# EAGLE design 549-team5 (EAGLE 7.2.0)
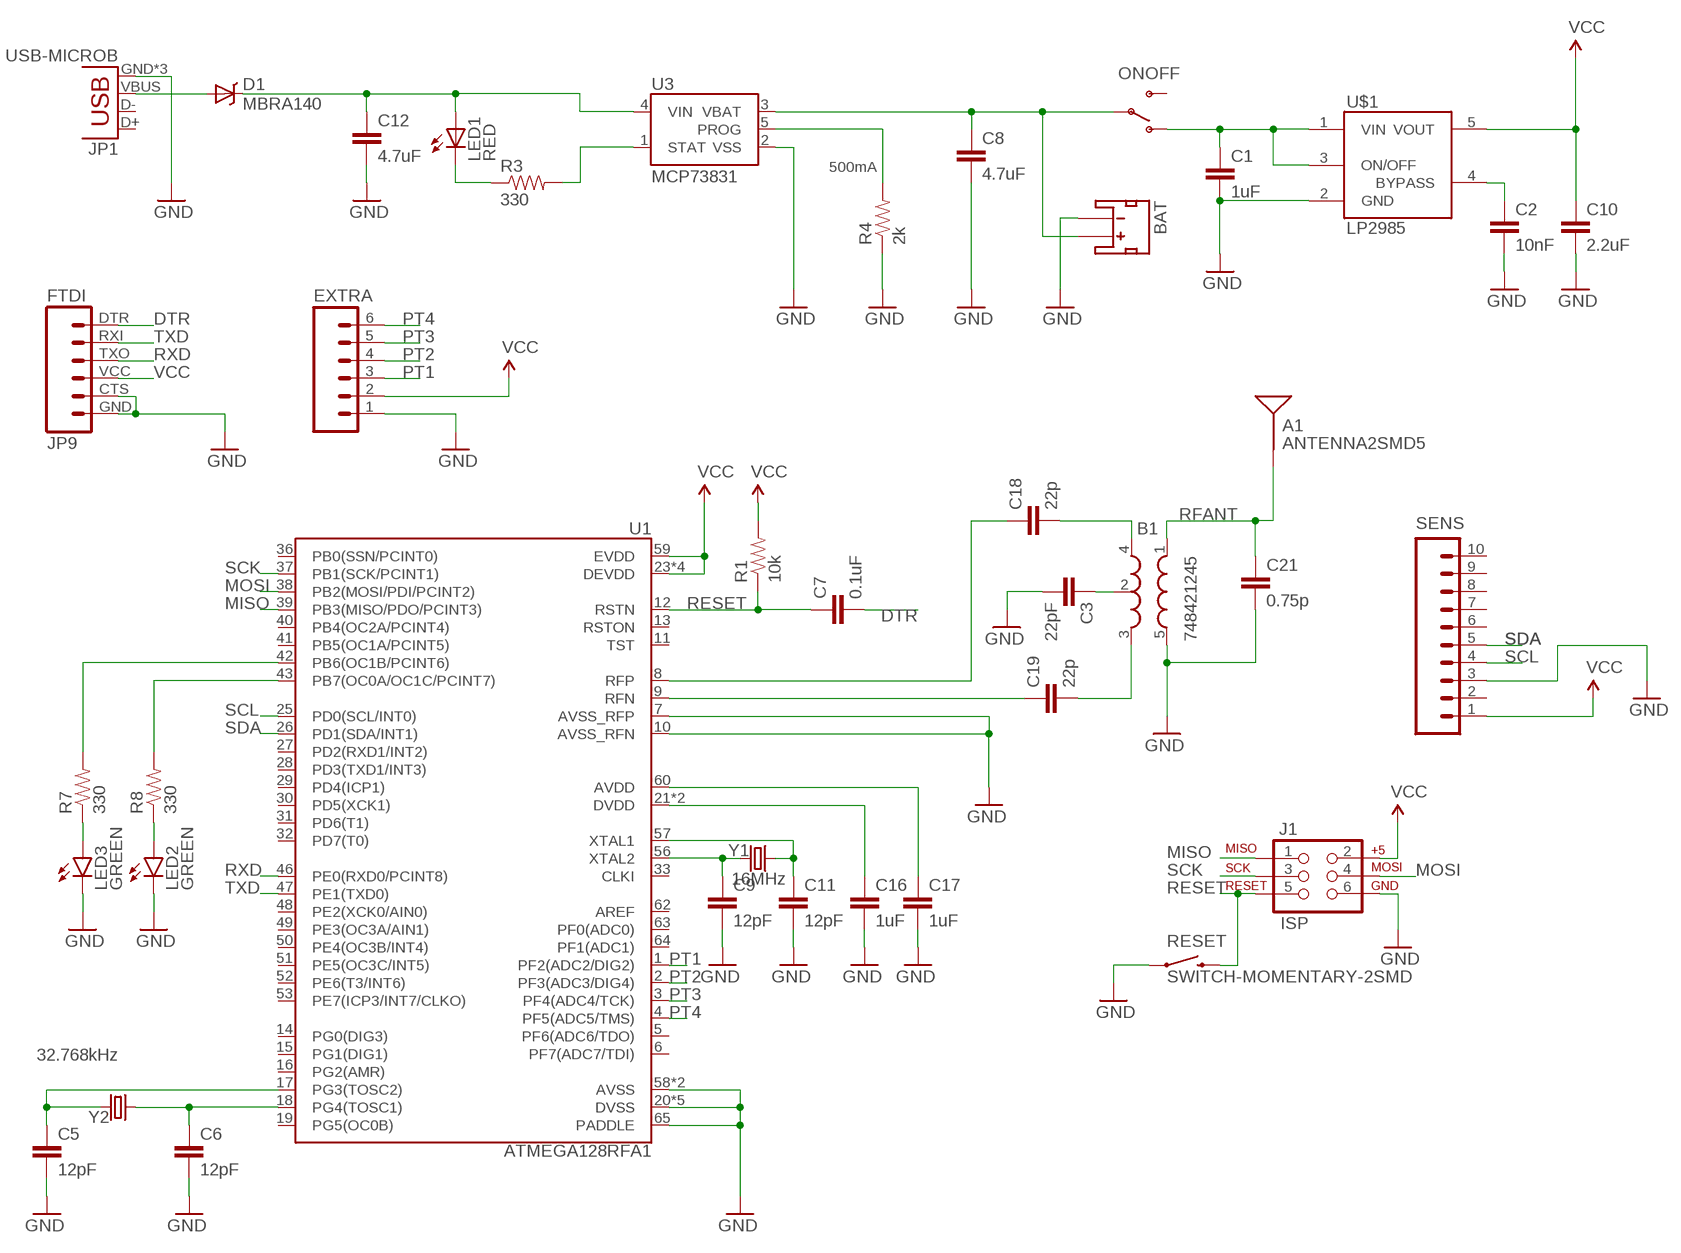
[diagram p0: schematic, sheet 1]

## Parts
A1  ANTENNA2SMD5  [ANTENNA-CHIP5]
B1  748421245  BALUN0805  [BALUN]
BAT  JST_2MM_MALE  [JST-2-SMD]
C1  1uF  CAP1206  [1206]
C2  10nF  CAP1206  [1206]
C3  22pF  CAP1206  [1206]
C5  12pF  CAP1206  [1206]
C6  12pF  CAP1206  [1206]
C7  0.1uF  CAP1206  [1206]
C8  4.7uF  CAP1206  [1206]
C9  12pF  CAP1206  [1206]
C10  2.2uF  CAP1206  [1206]
C11  12pF  CAP1206  [1206]
C12  4.7uF  CAP1206  [1206]
C16  1uF  CAP1206  [1206]
C17  1uF  CAP1206  [1206]
C18  22p  CAP1206  [1206]
C19  22p  CAP1206  [1206]
C21  0.75p  CAP1206  [1206]
D1  MBRA140  [SMA-DIODE]
EXTRA  M06SILK_FEMALE_PTH  [1X06]
J1  ISP  AVR_SPI_PRG_6NS  [2X3-NS]
JP1  USB-MICROB  [USB-MICROB]
JP9  FTDI  FTDI_BASICPTH  [FTDI_BASIC]
LED1  RED  LED1206  [LED-1206]
LED2  GREEN  LED1206  [LED-1206]
LED3  GREEN  LED1206  [LED-1206]
ONOFF  SWITCH-SPST-SMD-A  [SWITCH-SPST-SMD-A]
R1  10k  RESISTOR1206  [1206]
R3  330  RESISTOR1206  [1206]
R4  2k  RESISTOR1206  [1206]
R7  330  RESISTOR1206  [1206]
R8  330  RESISTOR1206  [1206]
RESET  SWITCH-MOMENTARY-2SMD  [TACTILE-SWITCH-SMD]
SENS  M10SILK_FEMALE_PTH  [1X10]
U1  ATMEGA128RFA1  [QFN-64]
U3  MCP73831  [SOT23-5]
U$1  LP2985AIM5-3.3  [SOT25]
Y1  16MHz  CRYSTAL5X3  [CRYSTAL-SMD-5X3]
Y2  32.768kHz  CRYSTAL32-SMD  [CRYSTAL-32KHZ-SMD]

## Nets
AVDD: C17.1 U1.60(AVDD)
BYPASS: C2.1 U$1.4(BYPASS)
DTR: C7.2 JP9.DTR
DVDD: C16.1 U1.21(DVDD) U1.22(DVDD)
GND: B1.5(GND) BAT.1(-) C1.2 C2.2 C3.2 C5.2 C6.2 C8.2 C9.2 C10.2 C11.2 C12.2 C16.2 C17.2 C21.2 EXTRA.1 J1.6 JP1.GND JP1.MT1(GND) JP1.MT2(GND) JP9.CTS JP9.GND LED2.C LED3.C R4.1 RESET.1 SENS.3 U1.7(AVSS_RFP) U1.10(AVSS_RFN) U1.20(DVSS) U1.24(DVSS) U1.35(DVSS) U1.45(DVSS) U1.55(DVSS) U1.58(AVSS) U1.61(AVSS) U1.65(PADDLE) U3.2(VSS) U$1.2(GND)
MISO: J1.1 U1.39(PB3(MISO/PDO/PCINT3))
MOSI: J1.4 U1.38(PB2(MOSI/PDI/PCINT2))
N$1: R8.2 U1.43(PB7(OC0A/OC1C/PCINT7))
N$3: C11.1 U1.57(XTAL1) Y1.3
N$4: C9.1 U1.56(XTAL2) Y1.1
N$5: C6.1 U1.18(PG4(TOSC1)) Y2.X1
N$6: C5.1 U1.17(PG3(TOSC2)) Y2.X2
N$7: C1.1 ONOFF.1(O) U$1.1(VIN) U$1.3(ON/OFF)
N$8: LED3.A R7.1
N$9: BAT.2(+) C8.1 ONOFF.2(P) U3.3(VBAT)
N$10: B1.4(OUT1) C18.2
N$11: B1.3(OUT2) C19.2
N$12: R7.2 U1.42(PB6(OC1B/PCINT6))
N$13: LED2.A R8.1
N$14: B1.2(GND) C3.1
N$15: C12.1 D1.C LED1.A U3.4(VIN)
N$18: R3.2 U3.1(STAT)
N$19: LED1.C R3.1
N$20: D1.A JP1.VBUS
PROG: R4.2 U3.5(PROG)
PT1: EXTRA.3 U1.1(PF2(ADC2/DIG2))
PT2: EXTRA.4 U1.2(PF3(ADC3/DIG4))
PT3: EXTRA.5 U1.3(PF4(ADC4/TCK))
PT4: EXTRA.6 U1.4(PF5(ADC5/TMS))
RESET: C7.1 J1.5 R1.1 RESET.3 U1.12(RSTN)
RFANT: A1.FEED(SIGNAL) B1.1(IN) C21.1
RFN: C19.1 U1.9(RFN)
RFP: C18.1 U1.8(RFP)
RXD: JP9.TXO U1.46(PE0(RXD0/PCINT8))
SCK: J1.3 U1.37(PB1(SCK/PCINT1))
SCL: SENS.4 U1.25(PD0(SCL/INT0))
SDA: SENS.5 U1.26(PD1(SDA/INT1))
TXD: JP9.RXI U1.47(PE1(TXD0))
VCC: C10.1 EXTRA.2 J1.2 JP9.VCC R1.2 SENS.1 U1.23(DEVDD) U1.34(DEVDD) U1.44(DEVDD) U1.54(DEVDD) U1.59(EVDD) U$1.5(VOUT)
Unconnected: BAT.NC1(PAD1) BAT.NC2(PAD2) JP1.D+ JP1.D- ONOFF.3(S) SENS.2 SENS.6 SENS.7 SENS.8 SENS.9 SENS.10 U1.5(PF6(ADC6/TDO)) U1.6(PF7(ADC7/TDI)) U1.11(TST) U1.13(RSTON) U1.14(PG0(DIG3)) U1.15(PG1(DIG1)) U1.16(PG2(AMR)) U1.19(PG5(OC0B)) U1.27(PD2(RXD1/INT2)) U1.28(PD3(TXD1/INT3)) U1.29(PD4(ICP1)) U1.30(PD5(XCK1)) U1.31(PD6(T1)) U1.32(PD7(T0)) U1.33(CLKI) U1.36(PB0(SSN/PCINT0)) U1.40(PB4(OC2A/PCINT4)) U1.41(PB5(OC1A/PCINT5)) U1.48(PE2(XCK0/AIN0)) U1.49(PE3(OC3A/AIN1)) U1.50(PE4(OC3B/INT4)) U1.51(PE5(OC3C/INT5)) U1.52(PE6(T3/INT6)) U1.53(PE7(ICP3/INT7/CLKO)) U1.62(AREF) U1.63(PF0(ADC0)) U1.64(PF1(ADC1))

## Notes on the sheet
- 500mA

## Library data of the parts
A1 = SparkFun-RF:ANTENNA2: Chip antenna Single endded antenna. Common with smaller chip antennas. CHIP4 package is the GPS Chip Antenna SKU: GPS-08418. CHIP5 package is 2.4GHz chip antenna SKU: WRL-00144.
B1 = SparkFun-RF:BALUN: 0805 footprint balun- Ember 351/357
BAT = SparkFun-Connectors:JST_2MM_MALE: Mates to single-cell LiPo batteries. CONN-08352; PROD_ID: CONN-08352
C1-C3 C5-C12 C16-C19 C21 = SparkFun-Capacitors:CAP: Capacitor Standard 0603 ceramic capacitor, and 0.1" leaded capacitor.
D1 = SparkFun-DiscreteSemi:MBRA140: 40V, 1A Schottky rectifier SMA/DO-214AC package DIO-08053; PROD_ID: DIO-08053
EXTRA = SparkFun-Connectors:M06: Header 6 Standard 6-pin 0.1" header. Use with straight break away headers (SKU : PRT-00116), right angle break away headers (PRT-00553), swiss pins (PRT-00743), machine pins (PRT-00117), and female headers (PRT-00115). Molex polarized connector foot print use with SKU : PRT-08094 with associated crimp pins and housings. NOTES ON THE VARIANTS LOCK and LOCK_LONGPADS... This footprint was designed to help hold the alignment of a through-hole component (i.e. 6-pin header) while soldering it into place. You may notice that each hole has been shifted either up or down by 0.005 of an inch from it's more standard position (which is a perfectly straight line). This slight alteration caused the pins (the squares in the middle) to touch the edges of the holes. Because they are alternating, it causes a "brace" to hold the component in place. 0.005 has proven to be the perfect amount of "off-center" position when using our standard breakaway headers. Although looks a little odd when you look at the bare footprint, once you have a header in there, the alteration is very hard to notice. Also,if you push a header all the way into place, it is covered up entirely on the bottom side. This idea of altering the position of holes to aid alignment will be further integrated into the Sparkfun Library for other footprints. It can help hold any component with 3 or more connection pins.; PROD_ID: CONN-08437
J1 = SparkFun-Connectors:AVR_SPI_PRG_6: AVR ISP 6 Pin This is the reduced ISP connector for AVR programming. Common on Arduino. This footprint will take up less PCB space and can be used with a 10-pin to 6-pin adapter such as SKU: BOB-08508
JP1 = SparkFun-Connectors:USB: USB Connectors USB-B-PTH is fully proven SKU : PRT-00139/CONN-08278 USB-miniB is fully proven SKU : PRT-00587 USB-A-PCB is untested. USB-A-H is throughly reviewed, but untested. Spark Fun Electronics SKU : PRT-00437 USB-B-SMT is throughly reviewed, but untested. Needs silkscreen touching up. USB-A-S has not been used/tested USB-MB-H has not been used/tested USB-MICROB has been used. CONN-09505; PROD_ID: CONN-09505
JP9 = SparkFun-Connectors:FTDI_BASIC: FTDI Basic header with labels
LED1 = LilyPad-Wearables:LED: LEDs
LED2 LED3 = SparkFun-LED:LED: LEDs
ONOFF = SparkFun:SWITCH-SPST: SPST Switch Simple slide switch. Spark Fun Electronics SKU : COM-00102
R1 R3 R4 R7 R8 = SparkFun-Passives:RESISTOR: Resistor Basic schematic elements and footprints for 0603, 1206, and PTH resistors.
RESET = SparkFun-Electromechanical:SWITCH-MOMENTARY-2: Various NO switches- pushbuttons, reed, etc; PROD_ID: SWCH-08247
SENS = SparkFun-Connectors:M10: Header 10 Standard 10-pin 0.1" header. Use with straight break away headers (SKU : PRT-00116), right angle break away headers (PRT-00553), swiss pins (PRT-00743), machine pins (PRT-00117), and female headers (PRT-00115).; PROD_ID: CONN-11563
U1 = SparkFun-DigitalIC:ATMEGA128RFA1: ATmega128RFA1 8-bit AVR Microcontroller with Low Power 2.4GHz Transceiver for ZigBee and IEEE 802.15.4
U3 = SparkFun-PowerIC:MCP73831: Miniature single cell, fully integrated Li-Ion, Li-polymer charge management controller http://ww1.microchip.com/downloads/en/DeviceDoc/21984a.pdf IC-09995; PROD_ID: IC-09995
U$1 = LP2985:LP2985: LP2985-N Micropower 150 mA Low-Noise Ultra Low-Dropout Regulator
Y1 Y2 = SparkFun-FreqCtrl:CRYSTAL: Various standard crystals. Proven footprints. Spark Fun Electronics SKU : COM-00534

## Board
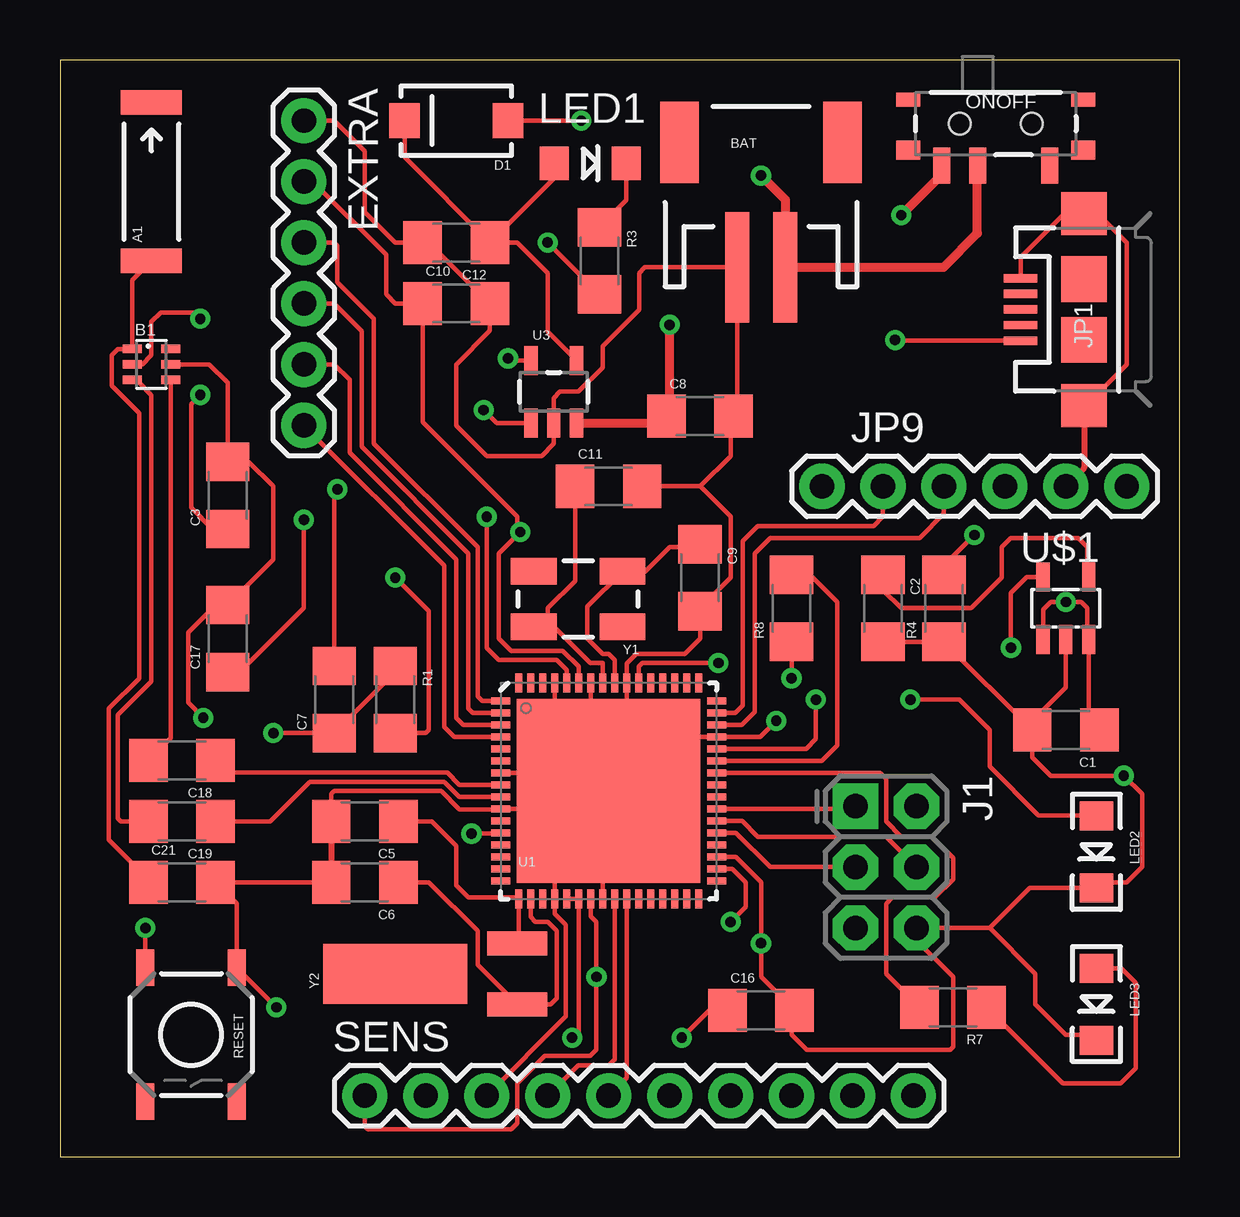
[diagram p1: board, top side]
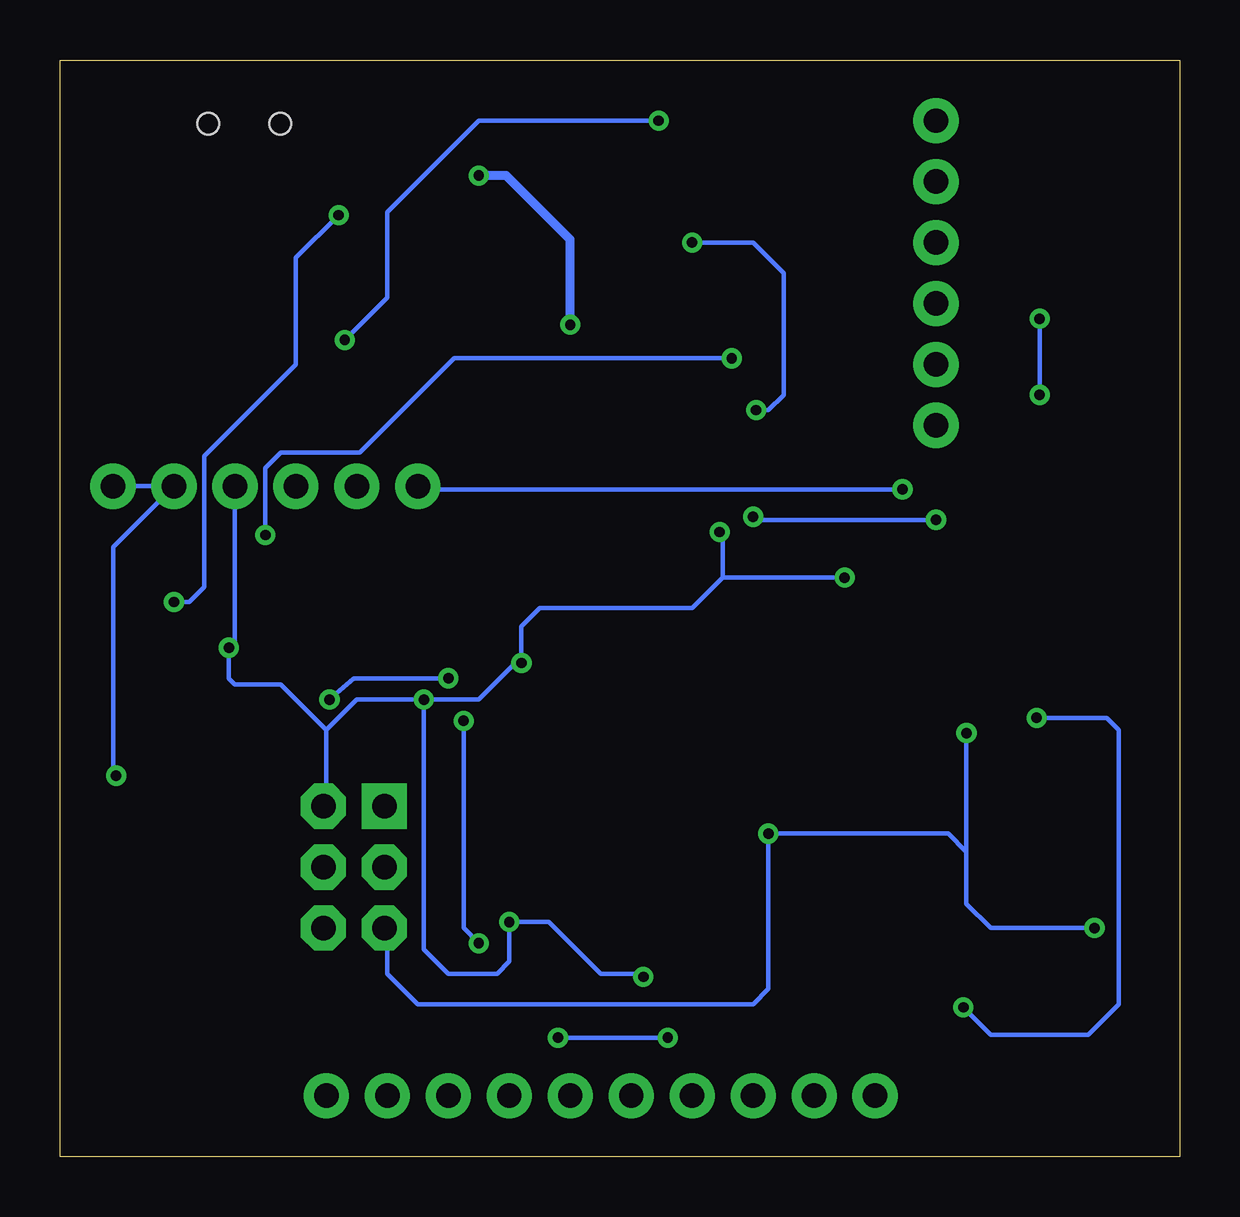
[diagram p2: board, bottom side, seen from below]

Size 46.66 x 45.71 mm. Coordinates in mm from the lower left corner, seen from the top.
Outline: 0,0 46.66,0 46.66,45.71 0,45.71 0,0
Copper layers (1*16): Top 0.035mm / dielectric 1.5mm / Bottom 0.035mm
Design rules "default *": minimum track width 7mil, minimum drill 16mil, track to track 7mil, track to pad 7mil, pad to pad 7mil, via to via 7mil, smd to smd 7mil, copper to edge 40mil, drill to drill 7mil, minimum pad ring 10mil, minimum via ring 8mil, stop-mask expansion 4mil, vias tented up to drill 0mil, thermal gap 10mil

### Footprints (pad centres in the part's own frame; a part is rotated, then mirrored left to right if it is on the bottom)
ANTENNA-CHIP5 = smd 1.016 x 2.54: FEED -3.302,0; NC 3.302,0
BALUN = smd 0.35 x 0.8: 1 -0.65,-0.8; 2 0,-0.8; 3 0.65,-0.8; 4 0.65,0.8; 5 0,0.8; 6 -0.65,0.8
JST-2-SMD = smd 1 x 4.6: 1 -1,-3.7; 2 1,-3.7 | smd 1.6 x 3.4: NC1 -3.4,1.5; NC2 3.4,1.5
1206 = smd 1.6 x 1.8: 1 -1.4,0; 2 1.4,0
SMA-DIODE = smd 1.27 x 1.47: A -2.15,0; C 2.15,0
1X06 = drill 1.016 pad 1.88: 1 0,0; 2 2.54,0; 3 5.08,0; 4 7.62,0; 5 10.16,0; 6 12.7,0
2X3-NS = drill 1.016 pad 1.88 square: 1 -2.54,-1.27 | drill 1.016 pad 1.88 octagon: 2 -2.54,1.27; 3 0,-1.27; 4 0,1.27; 5 2.54,-1.27; 6 2.54,1.27
USB-MICROB = smd 0.35 x 1.4: D+ 0,2.65; D- -0.65,2.65; GND 1.3,2.65; ID 0.65,2.65; VBUS -1.3,2.65 | smd 1.8 x 1.9: MT1 -4,0; MT2 4,0 | smd 1.9 x 1.9: P$1 -1.27,0; P$2 1.27,0
FTDI_BASIC = drill 1.016 pad 1.88: CTS 10.16,0; DTR 0,0; GND 12.7,0; RXI 2.54,0; TXO 5.08,0; VCC 7.62,0
LED-1206 = smd 1.2 x 1.4: A -1.5,0; C 1.5,0
SWITCH-SPST-SMD-A = smd 0.7 x 1.5: 1 -2.25,-1.75; 2 -0.75,-1.75; 3 2.25,-1.75 | smd 1 x 0.6: GND1 -3.65,1; GND3 3.65,1 | smd 1 x 0.8: GND2 -3.65,-1.1; GND4 3.65,-1.1 | hole 0.9: -1.5,0; 1.5,0
TACTILE-SWITCH-SMD = smd 1.524 x 0.762: 1 -2.794,1.905; 2 2.794,1.905; 3 -2.794,-1.905; 4 2.794,-1.905
1X10 = drill 1.016 pad 1.88: 1 0,0; 2 2.54,0; 3 5.08,0; 4 7.62,0; 5 10.16,0; 6 12.7,0; 7 15.24,0; 8 17.78,0; 9 20.32,0; 10 22.86,0
QFN-64 = smd 0.8 x 0.28: 1 -4.5,3.75; 2 -4.5,3.25; 3 -4.5,2.75; 4 -4.5,2.25; 5 -4.5,1.75; 6 -4.5,1.25; 7 -4.5,0.75; 8 -4.5,0.25; 9 -4.5,-0.25; 10 -4.5,-0.75; 11 -4.5,-1.25; 12 -4.5,-1.75; 13 -4.5,-2.25; 14 -4.5,-2.75; 15 -4.5,-3.25; 16 -4.5,-3.75; 33 4.5,-3.75; 34 4.5,-3.25; 35 4.5,-2.75; 36 4.5,-2.25; 37 4.5,-1.75; 38 4.5,-1.25; 39 4.5,-0.75; 40 4.5,-0.25; 41 4.5,0.25; 42 4.5,0.75; 43 4.5,1.25; 44 4.5,1.75; 45 4.5,2.25; 46 4.5,2.75; 47 4.5,3.25; 48 4.5,3.75 | smd 0.28 x 0.8: 17 -3.75,-4.5; 18 -3.25,-4.5; 19 -2.75,-4.5; 20 -2.25,-4.5; 21 -1.75,-4.5; 22 -1.25,-4.5; 23 -0.75,-4.5; 24 -0.25,-4.5; 25 0.25,-4.5; 26 0.75,-4.5; 27 1.25,-4.5; 28 1.75,-4.5; 29 2.25,-4.5; 30 2.75,-4.5; 31 3.25,-4.5; 32 3.75,-4.5; 49 3.75,4.5; 50 3.25,4.5; 51 2.75,4.5; 52 2.25,4.5; 53 1.75,4.5; 54 1.25,4.5; 55 0.75,4.5; 56 0.25,4.5; 57 -0.25,4.5; 58 -0.75,4.5; 59 -1.25,4.5; 60 -1.75,4.5; 61 -2.25,4.5; 62 -2.75,4.5; 63 -3.25,4.5; 64 -3.75,4.5 | smd 7.65 x 7.65: 65 0,0
SOT23-5 = smd 0.55 x 1.2: 1 -0.95,-1.3; 2 0,-1.3; 3 0.95,-1.3; 4 0.95,1.3; 5 -0.95,1.3
SOT25 = smd 0.55 x 1.2: 1 -0.95,-1.3; 2 0,-1.3; 3 0.95,-1.3; 4 0.95,1.3; 5 -0.95,1.3
CRYSTAL-SMD-5X3 = smd 1.9 x 1.1: 1 -1.85,-1.15; 2 1.85,-1.15; 3 1.85,1.15; 4 -1.85,1.15
CRYSTAL-32KHZ-SMD = smd 2.5 x 6: SHEILD 0,5.08 | smd 1 x 2.5: X1 -1.27,0; X2 1.27,0

### Placement (x,y rotation side)
A1  3.81,40.64 90 top
B1  3.81,33.02 270 top
BAT  29.21,40.77 0 top
C1  41.91,17.78 180 top
C2  34.29,22.86 270 top
C3  6.99,27.56 90 top
C5  12.7,13.97 180 top
C6  12.7,11.43 180 top
C7  11.43,19.05 90 top
C8  26.67,30.86 0 top
C9  26.67,24.13 270 top
C10  16.51,35.56 0 top
C11  22.86,27.94 0 top
C12  16.51,38.1 180 top
C16  29.21,6.1 0 top
C17  6.99,21.59 90 top
C18  5.08,16.51 180 top
C19  5.08,13.97 180 top
C21  5.08,11.43 0 top
D1  16.51,43.18 180 top
EXTRA  10.16,43.18 270 top
J1  34.42,12.06 270 top
JP1  42.67,35.31 90 top
JP9  31.75,27.94 0 top
LED1  22.1,41.4 0 top
LED2  43.18,12.7 270 top
LED3  43.18,6.35 270 top
ONOFF  38.99,43.05 0 top
R1  13.97,19.05 270 top
R3  22.48,37.34 270 top
R4  36.83,22.86 90 top
R7  37.21,6.22 180 top
R8  30.48,22.86 90 top
RESET  5.46,5.08 270 top
SENS  12.7,2.54 0 top
U1  22.86,15.24 0 top
U3  20.57,31.88 0 top
U$1  41.91,22.86 0 top
Y1  21.59,23.24 180 top
Y2  19.05,7.62 90 top

### Tracks (layer width: path | path; a pad name or v marks a point on that pad's centre or on a via)
AVDD  (via drill 0.43)
  Top 0.178: U1.60 21.11,20.29 20.7,20.7 18.29,20.7 17.78,21.21 v17.78,26.67 | C17.1 7.49,20.19 10.16,22.86 v10.16,26.54
  Bottom 0.178: v10.16,26.54 17.65,26.54 v17.78,26.67
BYPASS
  Top 0.178: C2.1 34.29,23.62 35.05,22.86 37.97,22.86 39.24,24.13 39.24,25.4 39.62,25.78 42.42,25.78 42.8,25.4 42.8,24.22 U$1.4
DTR  (via drill 0.43)
  Top 0.178: C7.2 11.43,27.69 v11.56,27.81
  Bottom 0.178: v11.56,27.81 31.62,27.81 JP9.DTR
DVDD  (via drill 0.43)
  Top 0.178: U1.21 U1.22 21.61,5.23 v21.34,4.95 | C16.1 27.05,6.1 v25.91,4.95
  Bottom 0.178: v21.34,4.95 v25.91,4.95
GND  (via drill 0.43)
  Top 0.178: SENS.3 21.08,5.84 21.08,9.65 20.61,10.12 U1.20 20.61,15.24 | U1.35 28.15,12.49 29.21,11.43 v29.21,8.89 29.21,7.5 C16.2 30.48,5.97 30.48,5.08 31.11,4.45 37.08,4.45 37.21,4.57 37.21,7.49 35.69,9.02 J1.6 38.73,9.53 | 38.73,9.53 40.64,7.62 40.64,6.35 41.91,5.08 42.95,5.08 LED3.C | U1.7 20.32,15.99 | 20.32,15.99 21.59,15.99 | 21.59,15.99 22.11,15.99 U1.65 22.61,14.99 U1.24 | U1.58 22.11,17.78 | 22.11,17.78 22.11,16.51 21.59,15.99 | U1.61 20.61,16.28 20.32,15.99 | 23.61,18.53 U1.55 23.61,20.56 24,20.95 26.04,20.95 26.67,21.59 C9.2 26.67,22.86 27.94,24.13 27.94,26.67 26.67,27.94 | 23.61,18.53 22.86,17.78 22.11,17.78 | 23.61,18.53 24.65,17.49 U1.45 29.17,17.49 v29.84,18.16 | 20.61,15.24 20.61,15.7 20.32,15.99 | 20.61,15.24 19.86,14.49 U1.10 18.35,14.48 16.64,14.48 15.88,15.24 11.43,15.24 11.3,15.11 C5.2 | C6.2 C21.2 7.37,10.54 RESET.1 v9.02,6.22 | B1.5 6.22,33.02 6.99,32.26 C3.2 7.87,28.96 8.89,27.94 8.89,24.89 C17.2 6.48,22.99 5.33,21.84 5.33,18.92 v5.97,18.29 | 38.73,9.53 40.41,11.2 LED2.C 43.41,11.43 44.45,11.43 45.09,12.06 45.09,15.11 v44.32,15.88 41.27,15.88 40.51,16.64 C1.2 | U$1.2 41.91,19.56 40.64,18.29 40.64,17.91 C1.2 | EXTRA.1 11.43,43.18 12.7,41.91 12.7,39.37 13.97,38.1 C12.2 15.37,38.1 C10.2 17.91,34.42 16.51,33.02 16.51,30.48 17.78,29.21 20.07,29.21 20.57,29.72 U3.2 20.57,31.62 20.83,31.88 21.59,31.88 22.61,32.89 22.61,33.78 24.13,35.31 24.13,36.83 24.37,37.07 BAT.1 28.21,31 C8.2 27.94,30.73 27.94,29.21 26.67,27.94 | C2.2 R4.1 C1.2 | C11.2 26.67,27.94 | JP1.GND 40.02,37.48 41.91,39.37 42.61,39.37 JP1.MT2 42.74,39.37 43.18,39.37 44.45,38.1 44.45,33.02 42.74,31.31 JP1.MT1
  Top 0.254: C5.2 C6.2 | JP1.MT1 42.67,28.7 JP9.CTS | JP1.MT2 42.67,39.26
  Bottom 0.178: v5.97,18.29 3.05,18.29 2.54,17.78 2.54,6.35 3.81,5.08 7.87,5.08 v9.02,6.22 | JP9.GND JP9.CTS 44.45,25.4 44.45,16 v44.32,15.88 | v29.84,18.16 29.84,9.53 v29.21,8.89
MISO
  Top 0.178: U1.39 33.03,14.49 J1.1
MOSI
  Top 0.178: U1.38 28.43,13.99 29.08,13.34 34.42,13.34 J1.4
N$1
  Top 0.178: U1.43 31.73,16.49 32.38,17.14 32.38,23.11 31.37,24.13 30.61,24.13 R8.2
N$3
  Top 0.178: 20.32,22.1 20.57,22.1 22.1,20.57 22.61,20.57 U1.57 | 20.32,22.1 Y1.3 | C11.1 21.46,24 20.32,22.86 20.32,22.1
N$4
  Top 0.178: C9.1 26.54,25.4 25.4,25.4 24.39,24.39 Y1.1 21.97,22.92 21.97,21.59 22.61,20.95 22.86,20.95 23.11,20.7 U1.56
N$5
  Top 0.178: U1.18 19.61,9.98 19.81,9.78 20.32,9.78 20.7,9.4 20.7,6.6 20.45,6.35 Y2.X1 17.4,8 17.4,9.4 15.37,11.43 C6.1
N$6
  Top 0.178: Y2.X2 19.11,8.95 U1.17 19.05,10.79 17.02,10.79 16.51,11.3 16.51,12.95 15.49,13.97 C5.1 13.97,13.97
N$7  (via drill 0.43)
  Top 0.178: C1.1 42.86,18.23 U$1.3 42.8,21.62 42.8,22.86 42.55,23.11 v41.91,23.11 41.27,23.11 40.96,22.8 U$1.1 | ONOFF.1 36.74,40.93
  Top 0.381: 36.74,40.93 v35.05,39.24
  Bottom 0.178: v41.91,23.11 41.27,23.11 40.64,23.75 40.64,29.21 36.83,33.02 36.83,37.47 v35.05,39.24
N$8
  Top 0.178: LED3.A 44.22,7.85 44.83,7.24 44.83,3.68 44.2,3.05 41.79,3.05 R7.1
N$9  (via drill 0.43)
  Top 0.178: 25.4,30.99 C8.1 | 38.1,41.16 ONOFF.2
  Top 0.381: U3.3 24.99,30.58 C8.1 | 25.4,30.99 v25.4,34.67 | v29.21,40.89 30.23,39.88 30.23,37.08 BAT.2 36.81,37.07 38.23,38.48 38.23,41.29 ONOFF.2
  Top 0.508: 25.27,30.58 C8.1 | v25.4,34.67 25.27,34.67
  Bottom 0.381: v25.4,34.67 25.4,38.23 28.07,40.89 v29.21,40.89
N$10
  Top 0.178: B1.4 4.61,17.44 C18.2
N$11
  Top 0.178: B1.3 3.19,32.37 3.81,31.75 3.81,19.81 2.41,18.41 2.41,14.1 2.54,13.97 C19.2
N$12
  Top 0.178: U1.42 34.17,15.99 34.42,15.75 34.42,13.97 35.05,13.34 36.32,13.34 37.21,12.45 37.21,11.56 36.45,10.79 34.67,10.79 34.42,10.54 34.42,7.62 R7.2
N$13  (via drill 0.43)
  Top 0.178: R8.1 v30.48,19.94 | v35.43,19.05 37.47,19.05 38.73,17.78 38.73,16.26 40.77,14.22 43.16,14.22 LED2.A
  Bottom 0.178: v30.48,19.94 34.42,19.94 v35.43,19.05
N$14  (via drill 0.43)
  Top 0.178: C3.1 6.35,26.16 5.46,27.05 5.46,31.37 v5.84,31.75 | B1.2 3.43,33.02 3.81,33.4 3.81,34.8 4.19,35.18 5.59,35.18 v5.84,34.92
  Bottom 0.178: v5.84,34.92 v5.84,31.75
N$15
  Top 0.178: D1.C 14.36,41.65 C12.1 | LED1.A 20.6,40.79 C12.1 | C12.1 19.05,38.1 20.32,36.83 20.32,34.38 U3.4
N$18  (via drill 0.43)
  Top 0.178: R3.2 v20.32,38.1 | U3.1 18.19,30.58 v17.65,31.11
  Bottom 0.178: v17.65,31.11 17.14,31.11 16.51,31.75 16.51,36.83 17.78,38.1 v20.32,38.1
N$19
  Top 0.178: LED1.C 23.6,39.86 R3.1
N$20  (via drill 0.43)
  Top 0.178: D1.A v21.72,43.18 | JP1.VBUS 34.83,34.01 v34.8,34.04
  Bottom 0.178: v21.72,43.18 29.21,43.18 33.02,39.37 33.02,35.81 v34.8,34.04
PROG  (via drill 0.43)
  Top 0.178: R4.2 36.83,24.64 v38.1,25.91 | U3.5 18.77,33.18 v18.67,33.27
  Bottom 0.178: v38.1,25.91 38.1,28.7 37.47,29.34 34.16,29.34 30.23,33.27 v18.67,33.27
PT1
  Top 0.178: U1.1 17.59,18.99 17.4,19.18 17.4,25.4 13.08,29.72 13.08,34.92 11.56,36.45 11.56,37.97 11.43,38.1 EXTRA.3
PT2
  Top 0.178: U1.2 17.2,18.49 17.02,18.67 17.02,25.15 12.57,29.59 12.57,34.42 11.43,35.56 EXTRA.4
PT3
  Top 0.178: U1.3 16.81,17.99 16.51,18.29 16.51,24.89 12.06,29.34 12.06,32.38 11.43,33.02 EXTRA.5
PT4
  Top 0.178: U1.4 16.42,17.49 16,17.91 16,24.64 EXTRA.6
RESET  (via drill 0.43)
  Top 0.178: v17.14,13.46 18.33,13.46 U1.12 | RESET.3 v3.56,9.53 | R1.1 13.97,20.19 C7.1 v8.89,17.65
  Bottom 0.178: v8.89,17.65 8.89,12.7 | 8.89,12.7 8.89,10.54 7.87,9.53 v3.56,9.53 | 8.89,12.7 9.65,13.46 v17.14,13.46 17.14,6.99 17.78,6.35 31.75,6.35 33.02,7.62 33.02,9.4 J1.5
RFANT
  Top 0.178: 3.81,11.43 C21.1 3.68,11.56 2.03,13.21 2.03,18.67 3.3,19.94 3.3,30.99 2.16,32.13 2.16,33.4 2.41,33.66 3,33.66 B1.1 3.01,36.54 A1.FEED
RFN
  Top 0.178: U1.9 16.63,14.99 16,15.62 10.41,15.62 8.76,13.97 C19.1
RFP
  Top 0.178: U1.8 16.64,15.49 16.13,16 6.99,16 C18.1
RXD
  Top 0.178: U1.46 28.4,17.99 28.96,18.54 28.96,25.15 29.59,25.78 35.81,25.78 36.83,26.8 JP9.TXO
SCK
  Top 0.178: U1.37 28.17,13.49 29.59,12.06 J1.3
SCL
  Top 0.178: U1.25 23.11,4.06 22.86,3.81 21.59,3.81 SENS.4
SDA
  Top 0.178: U1.26 23.61,3.29 SENS.5
TXD
  Top 0.178: U1.47 28.14,18.49 28.45,18.8 28.45,25.65 29.08,26.29 33.91,26.29 34.29,26.67 JP9.RXI
VCC  (via drill 0.43)
  Top 0.178: SENS.1 12.7,1.27 12.83,1.14 18.8,1.14 19.05,1.4 19.05,3.05 20.19,4.19 22.1,4.19 22.35,4.45 v22.35,7.49 22.35,9.78 22.11,10.02 U1.23 | EXTRA.2 10.54,40.64 13.59,37.59 13.59,35.94 13.97,35.56 C10.1 15.11,30.61 19.05,26.67 19.05,26.16 v19.18,26.04 18.29,25.15 18.29,21.59 18.8,21.08 20.95,21.08 21.61,20.43 U1.59 | U1.54 24.11,20.43 24.26,20.57 v27.43,20.57 | U1.34 28.02,11.99 28.57,11.43 28.57,10.41 v27.94,9.78 | U1.44 31.09,16.99 31.5,17.4 v31.5,19.05 | U$1.5 40.29,24.16 39.62,23.5 v39.62,21.21 | R1.2 15.24,17.65 15.37,17.78 15.37,22.73 v13.97,24.13
  Bottom 0.178: 19.05,24.13 20.32,22.86 26.67,22.86 27.43,22.1 v27.43,20.57 27.69,20.57 29.21,19.05 v31.5,19.05 | 19.05,24.13 19.05,25.91 v19.18,26.04 | v31.5,19.05 34.29,19.05 35.56,17.78 | 35.56,17.78 35.56,14.73 J1.2 | v22.35,7.49 22.48,7.62 24.13,7.62 26.29,9.78 v27.94,9.78 27.94,8.13 28.45,7.62 30.48,7.62 31.5,8.64 v31.5,19.05 | 35.56,17.78 37.47,19.68 39.37,19.68 39.62,19.94 v39.62,21.21 39.37,21.46 JP9.VCC | v13.97,24.13 19.05,24.13